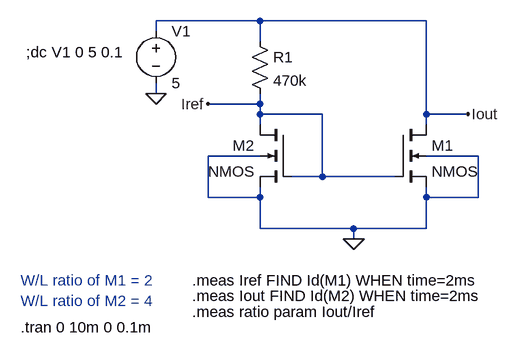
[diagram p0: schematic simple_current_mirror.asc]
simple_current_mirror.asc, the LTspice schematic file:
Version 4
SHEET 1 884 680
WIRE 80 -16 -80 -16
WIRE 336 -16 80 -16
WIRE -80 0 -80 -16
WIRE 80 16 80 -16
WIRE -80 96 -80 80
WIRE 80 112 80 96
WIRE 80 112 0 112
WIRE 80 128 80 112
WIRE 176 128 80 128
WIRE 336 128 336 -16
WIRE 400 128 336 128
WIRE 80 144 80 128
WIRE 336 144 336 128
WIRE 80 192 0 192
WIRE 416 192 336 192
WIRE 176 224 176 128
WIRE 176 224 128 224
WIRE 288 224 176 224
WIRE 0 256 0 192
WIRE 80 256 80 240
WIRE 80 256 0 256
WIRE 336 256 336 240
WIRE 416 256 416 192
WIRE 416 256 336 256
WIRE 80 304 80 256
WIRE 224 304 80 304
WIRE 336 304 336 256
WIRE 336 304 224 304
WIRE 224 320 224 304
FLAG -80 96 0
FLAG 224 320 0
FLAG 400 128 Iout
FLAG 0 112 Iref
SYMBOL nmos4 288 144 R0
SYMATTR InstName M1
SYMATTR Value2 l=5u w=20u
SYMBOL nmos4 128 144 M0
SYMATTR InstName M2
SYMATTR Value2 l=5u w=10u
SYMBOL res 64 0 R0
SYMATTR InstName R1
SYMATTR Value 470k
SYMBOL voltage -80 -16 R0
WINDOW 123 0 0 Left 0
WINDOW 39 0 0 Left 0
SYMATTR InstName V1
SYMATTR Value 5
TEXT -280 32 Left 2 !;dc V1 0 5 0.1
TEXT -24 408 Left 2 !.meas Iout FIND Id(M2) WHEN time=2ms
TEXT -24 384 Left 2 !.meas Iref FIND Id(M1) WHEN time=2ms
TEXT -24 432 Left 2 !.meas ratio param Iout/Iref
TEXT -288 384 Left 2 ;W/L ratio of M1 = 2\nW/L ratio of M2 = 4
TEXT -288 456 Left 2 !.tran 0 10m 0 0.1m

The netlist it stands for:
* simple_current_mirror.asc
M1 Iout Iref 0 0 NMOS l=5u w=20u
M2 Iref Iref 0 0 NMOS l=5u w=10u
R1 Iout Iref 470k
V1 Iout 0 5
.model NMOS NMOS
.model PMOS PMOS
.lib standard.mos
;dc V1 0 5 0.1
.meas Iout FIND Id(M2) WHEN time=2ms
.meas Iref FIND Id(M1) WHEN time=2ms
.meas ratio param Iout/Iref
* W/L ratio of M1 = 2
* W/L ratio of M2 = 4
.tran 0 10m 0 0.1m
.backanno
.end